# EasyEDA schematic SCH_TRINIT_BYTE-HOGS_IOT_2023-02-12.json
TITLE: Circuit Diagram; REV: 1.0; Date: 2023-02-11; Sheet: 1/1; Drawn By: TRINIT_BYTE-HOGS_IOT; Company: BYTE-HOGS
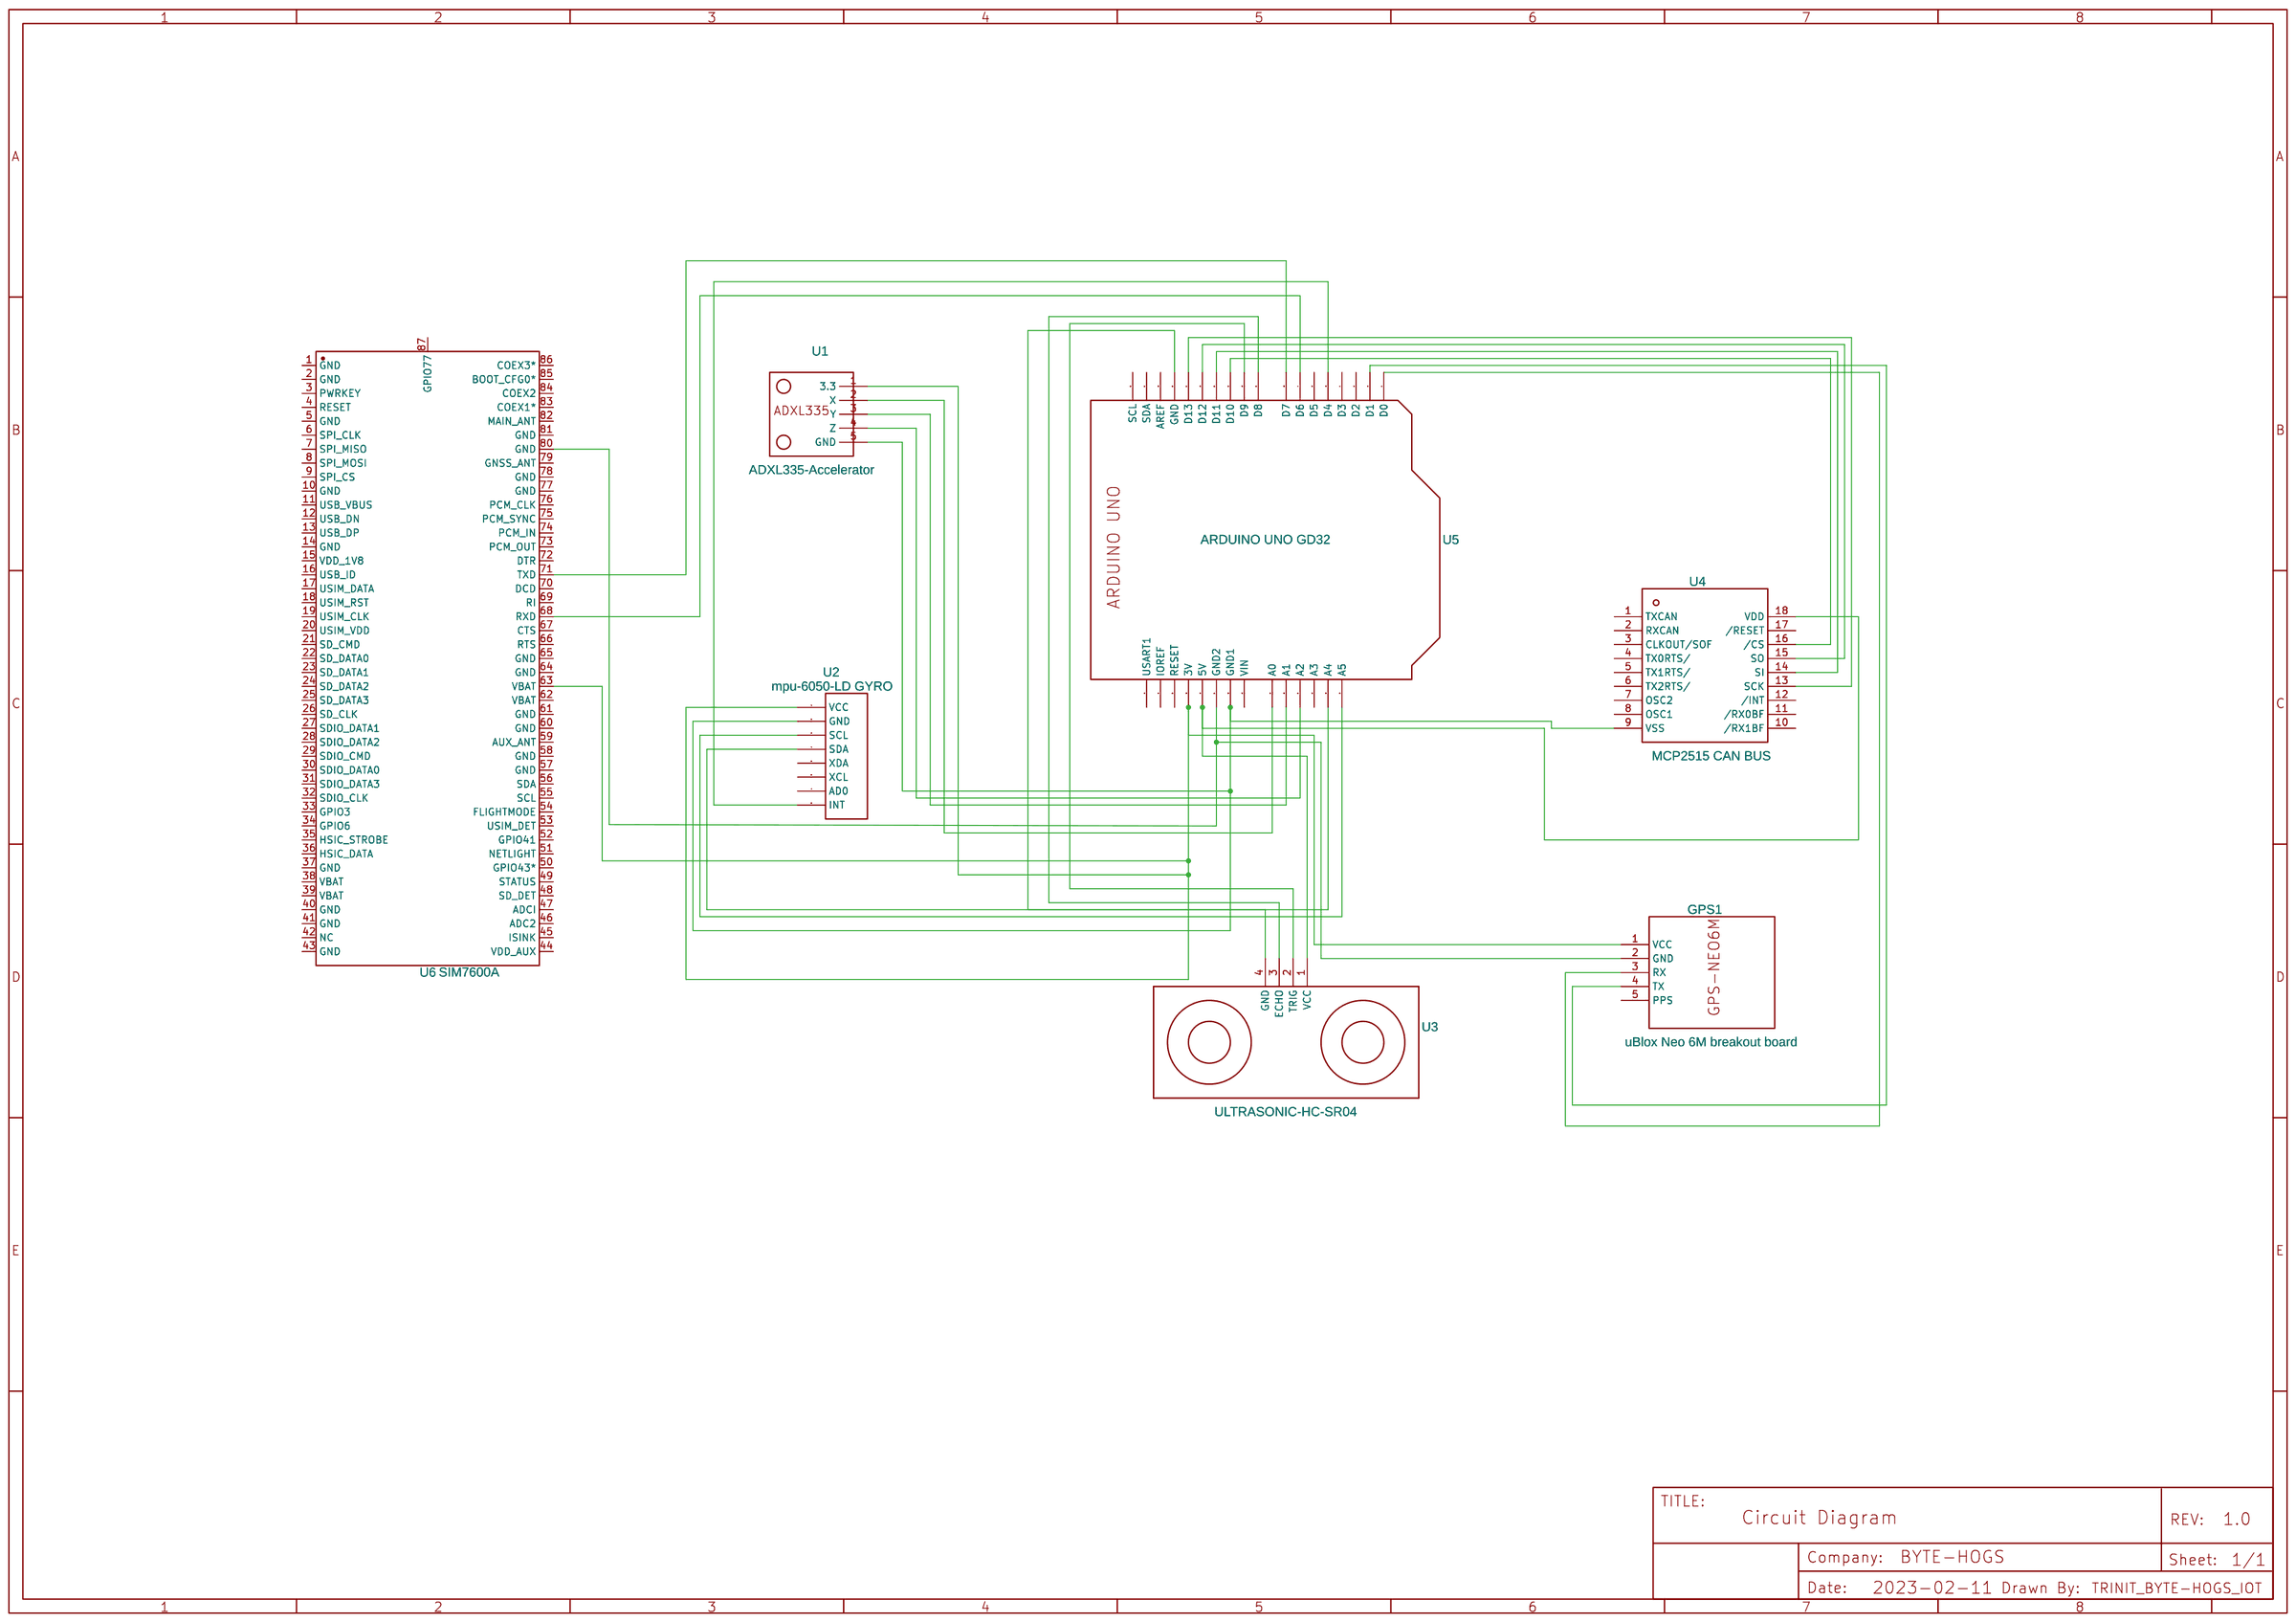
[diagram p0: schematic sheet]

## Parts
GPS1  uBlox Neo 6M breakout board  [GY-NEO6MV2]
U1  ADXL335-Accelerator  [ADXL335]
U2  mpu-6050-LD GYRO  [MPU-6050-LD]
U3  ULTRASONIC-HC-SR04  [ULTRASONIC-HC-SR04]
U4  MCP2515 CAN BUS  [MCP2515]
U5  ARDUINO UNO GD32  [UNO_R3;WO ARDUINO UNO]
U6  SIM7600A  [COMM-SMD_L30.0-W30.0_SIM7600E]

## Library data of the parts
GPS1 = uBlox Neo 6M breakout board: Manufacturer Part: GY-NEO6M; Contributor: olex
U1 = ADXL335: Contributor: Najwazzahari
U2 = mpu-6050-LD: Contributor: usb3.0
U3 = ULTRASONIC-HC-SR04: Ultrasonic Ranging Module HC-SR04; sourceId: iECXHFpLv; Contributor: DUDU123
U4 = MCP2515 COPY: Contributor: yilmaz0emre
U5 = ARDUINO UNO GD32: Contributor: obaida.bohsas.shark; sourceId: frlCUcuMG
U6 = SIM7600A: Supplier: LCSC; Supplier Part: C2995537; Manufacturer: SIMCOM(芯讯通无线科技); Contributor: lcsc; JLCPCB Part Class: Extended Part

## Nets
Net-(GPS1-1): GPS1.1(VCC) U1.1(3.3) U2.1(VCC) U5.29(3V) U6.63(VBAT)
Net-(GPS1-2): GPS1.2(GND) U5.27(GND2) U6.80(GND)
Net-(GPS1-3): GPS1.3(RX) U5.1(D0)
Net-(GPS1-4): GPS1.4(TX) U5.2(D1)
Net-(U1-2): U1.2(X) U5.24(A0)
Net-(U1-3): U1.3(Y) U5.23(A1)
Net-(U1-4): U1.4(Z) U5.22(A2)
Net-(U1-5): U1.5(GND) U2.2(GND) U4.9(VSS) U5.26(GND1)
Net-(U2-3): U2.3(SCL) U5.19(A5)
Net-(U2-4): U2.4(SDA) U5.20(A4)
Net-(U2-8): U2.8(INT) U5.5(D4)
Net-(U3-1): U3.1(VCC) U4.18(VDD) U5.28(5V)
Net-(U3-2): U3.2(TRIG) U5.10(D9)
Net-(U3-3): U3.3(ECHO) U5.9(D8)
Net-(U3-4): U3.4(GND) U5.15(GND)
Net-(U4-13): U4.13(SCK) U5.14(D13)
Net-(U4-14): U4.14(SI) U5.12(D11)
Net-(U4-15): U4.15(SO) U5.13(D12)
Net-(U4-16): U4.16(/CS) U5.11(D10)
Net-(U5-7): U5.7(D6) U6.68(RXD)
Net-(U5-8): U5.8(D7) U6.71(TXD)

Not connected (* = marked no-connect by the designer): GPS1 5(PPS); U2 5(XDA) 6(XCL) 7(AD0); U4 1(TXCAN) 2(RXCAN) 3(CLKOUT/SOF) 4(TX0RTS/) 5(TX1RTS/) 6(TX2RTS/) 7(OSC2) 8(OSC1) 10(/RX1BF) 11(/RX0BF) 12(/INT) 17(/RESET); U5 3(D2) 4(D3) 6(D5) 16(AREF) 17(SDA) 18(SCL) 21(A3) 25(VIN) 30(RESET) 31(IOREF) 32(USART1); U6 1(GND) 2(GND) 3(PWRKEY) 4(RESET) 5(GND) 6(SPI_CLK) 7(SPI_MISO) 8(SPI_MOSI) 9(SPI_CS) 10(GND) 11(USB_VBUS) 12(USB_DN) 13(USB_DP) 14(GND) 15(VDD_1V8) 16(USB_ID) 17(USIM_DATA) 18(USIM_RST) 19(USIM_CLK) 20(USIM_VDD) 21(SD_CMD) 22(SD_DATA0) 23(SD_DATA1) 24(SD_DATA2) 25(SD_DATA3) 26(SD_CLK) 27(SDIO_DATA1) 28(SDIO_DATA2) 29(SDIO_CMD) 30(SDIO_DATA0) 31(SDIO_DATA3) 32(SDIO_CLK) 33(GPIO3) 34(GPIO6) 35(HSIC_STROBE) 36(HSIC_DATA) 37(GND) 38(VBAT) 39(VBAT) 40(GND) 41(GND) 42(NC) 43(GND) 44(VDD_AUX) 45(ISINK) 46(ADC2) 47(ADCI) 48(SD_DET) 49(STATUS) 50(GPIO43*) 51(NETLIGHT) 52(GPIO41) 53(USIM_DET) 54(FLIGHTMODE) 55(SCL) 56(SDA) 57(GND) 58(GND) 59(AUX_ANT) 60(GND) 61(GND) 62(VBAT) 64(GND) 65(GND) 66(RTS) 67(CTS) 69(RI) 70(DCD) 72(DTR) 73(PCM_OUT) 74(PCM_IN) 75(PCM_SYNC) 76(PCM_CLK) 77(GND) 78(GND) 79(GNSS_ANT) 81(GND) 82(MAIN_ANT) 83(COEX1*) 84(COEX2) 85(BOOT_CFG0*) 86(COEX3*) 87(GPIO77)
